# Altium schematic sheet Sheet1.SchDoc
size A4; SheetNumber: 1; SheetTotal: 2
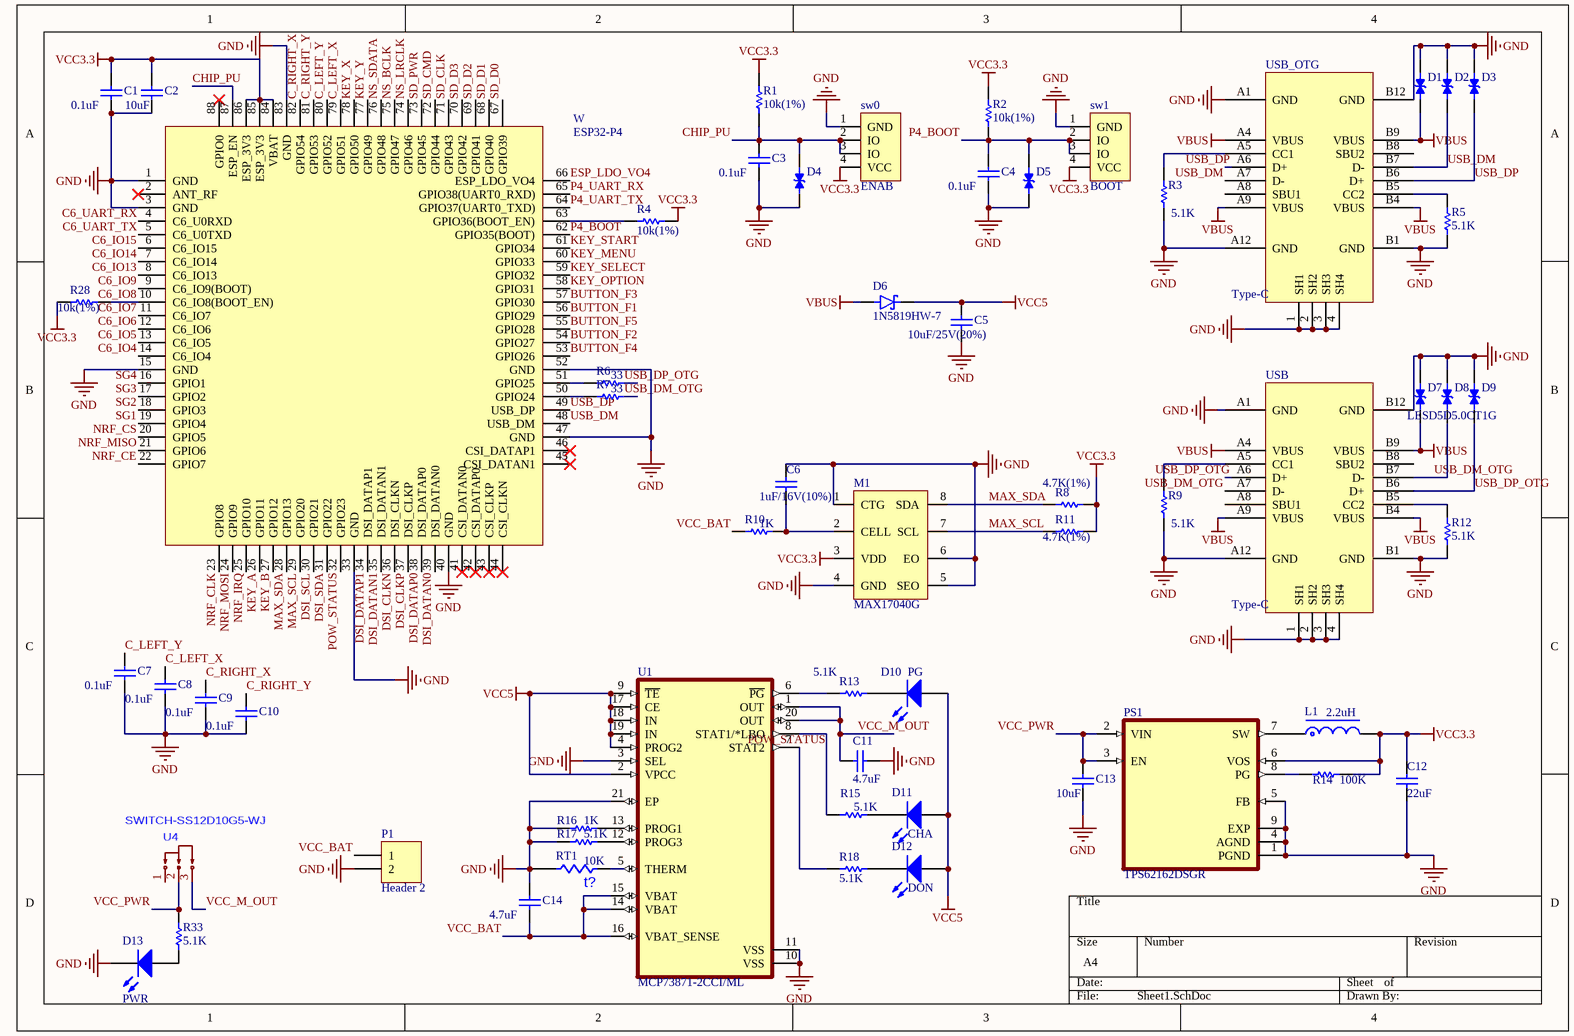
[diagram p0: Sheet1.SchDoc]

## Parts
C1  value 0.1uF  [C0805]  (hidden comment: 0.1uF/50V(10%))
C2  10uF  [C0805]
C3  value 0.1uF  [C0805]  (hidden comment: 0.1uF/50V(10%))
C4  value 0.1uF  [C0805]  (hidden comment: 0.1uF/50V(10%))
C5  10uF/25V(20%)  [C0805]
C6  1uF/16V(10%)  [C0805]
C7  value 0.1uF  [C0805]  (hidden comment: 0.1uF/50V(10%))
C8  value 0.1uF  [C0805]  (hidden comment: 0.1uF/50V(10%))
C9  value 0.1uF  [C0805]  (hidden comment: 0.1uF/50V(10%))
C10  value 0.1uF  [C0805]  (hidden comment: 0.1uF/50V(10%))
C11  4.7uF  [C0805]
C12  22uF  [C0805]
C13  10uF  [C0805]
C14  4.7uF  [C0805]
D1  (no value)  [TVS_LESD5D5.0CT1G]
D2  (no value)  [TVS_LESD5D5.0CT1G]
D3  (no value)  [TVS_LESD5D5.0CT1G]
D4  (no value)  [TVS_LESD5D5.0CT1G]
D5  (no value)  [TVS_LESD5D5.0CT1G]
D6  1N5819HW-7  [SOD3715X145N]
D7  (no value)  [TVS_LESD5D5.0CT1G]
D8  LESD5D5.0CT1G  [TVS_LESD5D5.0CT1G]
D9  (no value)  [TVS_LESD5D5.0CT1G]
D10  PG  [C0805]
D11  CHA  [C0805]
D12  DON  [C0805]
D13  PWR  [C0805]
L1  2.2uH  [INDC6060X300]
M1  MAX17040G  [MAX17040G+T]
P1  Header 2  [XH2.54-2P]
PS1  TPS62162DSGR  [TPS62162DSGR]
R1  10k(1%)  [C0805]
R2  10k(1%)  [C0805]
R3  5.1K  [C0805]
R4  10k(1%)  [C0805]
R5  5.1K  [C0805]
R6  33  [C0805]
R7  33  [C0805]
R8  4.7K(1%)  [C0805]
R9  5.1K  [C0805]
R10  1K  [C0805]
R11  4.7K(1%)  [C0805]
R12  5.1K  [C0805]
R13  5.1K  [C0805]
R14  100K  [C0805]
R15  5.1K  [C0805]
R16  1K  [C0805]
R17  5.1K  [C0805]
R18  5.1K  [C0805]
R28  10k(1%)  [C0805]
R33  5.1K  [C0805]
RT1  10K  [NTC]
sw0  ENAB  [SWITH_Light]
sw1  BOOT  [SWITH_Light]
U1  MCP73871-2CCI/ML  [MCP73871]
U4  SWITCH-SS12D10G5-WJ  [SW-TH_SS12D10G5]
USB  Type-C  [Type-C-TOP]
USB_OTG  Type-C  [Type-C-TOP]
W  ESP32-P4  [ESP32-P4_MODULE]

## Nets
GND: C1.1 C2.1 C3.1 C4.1 C5.1 C6.2 C7.1 C8.1 C9.1 C10.1 C11.2 C12.1 C13.1 C14.2 D1.2 D2.2 D3.2 D4.1 D5.1 D7.2 D8.2 D9.2 D13.2(K) M1.1(CTG) M1.4(GND) M1.5(SEO) M1.6(EO) P1.2 PS1.1(PGND) PS1.4(AGND) PS1.5(FB) PS1.9(EXP) R3.1 R5.1 R9.1 R12.1 R16.2 R17.2 RT1.2 sw0.1(GND) sw1.1(GND) U1.3(SEL) U1.10(VSS) U1.11(VSS) U1.21(EP) USB.1(SH1) USB.2(SH2) USB.3(SH3) USB.4(SH4) USB.A1(GND) USB.A12(GND) USB.B1(GND) USB.B12(GND) USB_OTG.1(SH1) USB_OTG.2(SH2) USB_OTG.3(SH3) USB_OTG.4(SH4) USB_OTG.A1(GND) USB_OTG.A12(GND) USB_OTG.B1(GND) USB_OTG.B12(GND) W.1(GND) W.3(GND) W.15(GND) W.33(GND) W.40(GND) W.47(GND) W.52(GND) W.83(GND)
VBUS: D1.1 D6.A D7.1 USB.A4(VBUS) USB.A9(VBUS) USB.B4(VBUS) USB.B9(VBUS) USB_OTG.A4(VBUS) USB_OTG.A9(VBUS) USB_OTG.B4(VBUS) USB_OTG.B9(VBUS)
VCC3.3: C1.2 C2.2 C12.2 L1.2 M1.3(VDD) PS1.6(VOS) R1.2 R2.2 R4.2 R8.2 R11.2 R14.1 R28.2 sw0.4(VCC) sw1.4(VCC) W.84(VBAT) W.85(ESP_3V3) W.86(ESP_3V3)
VCC5: C5.2 D6.C(K) D10.1(A) D11.1(A) D12.1(A) U1.2(VPCC) U1.4(PROG2) U1.9(~{TE}) U1.17(CE) U1.18(IN) U1.19(IN)
BUTTON_F1: W.56(GPIO29)
BUTTON_F2: W.54(GPIO27)
BUTTON_F3: W.57(GPIO30)
BUTTON_F4: W.53(GPIO26)
BUTTON_F5: W.55(GPIO28)
C6_IO4: W.14(C6_IO4)
C6_IO5: W.13(C6_IO5)
C6_IO6: W.12(C6_IO6)
C6_IO7: W.11(C6_IO7)
C6_IO8: R28.1 W.10(C6_IO8(BOOT_EN))
C6_IO9: W.9(C6_IO9(BOOT))
C6_IO13: W.8(C6_IO13)
C6_IO14: W.7(C6_IO14)
C6_IO15: W.6(C6_IO15)
C6_UART_RX: W.4(C6_U0RXD)
C6_UART_TX: W.5(C6_U0TXD)
C_LEFT_X: C8.2 W.79(GPIO51)
C_LEFT_Y: C7.2 W.80(GPIO52)
C_RIGHT_X: C9.2 W.82(GPIO54)
C_RIGHT_Y: C10.2 W.81(GPIO53)
CHIP_PU: C3.2 D4.2 R1.1 sw0.2(IO) sw0.3(IO) W.87(ESP_EN)
DSI_CLKN: W.36(DSI_CLKN)
DSI_CLKP: W.37(DSI_CLKP)
DSI_DATAN0: W.39(DSI_DATAN0)
DSI_DATAN1: W.35(DSI_DATAN1)
DSI_DATAP0: W.38(DSI_DATAP0)
DSI_DATAP1: W.34(DSI_DATAP1)
DSI_SCL: W.30(GPIO21)
DSI_SDA: W.31(GPIO22)
ESP_LDO_VO4: W.66(ESP_LDO_VO4)
KEY_A: W.26(GPIO11)
KEY_B: W.27(GPIO12)
KEY_MENU: W.60(GPIO33)
KEY_OPTION: W.58(GPIO31)
KEY_SELECT: W.59(GPIO32)
KEY_START: W.61(GPIO34)
KEY_X: W.78(GPIO50)
KEY_Y: W.77(GPIO49)
MAX_SCL: M1.7(SCL) R11.1 W.29(GPIO20)
MAX_SDA: M1.8(SDA) R8.1 W.28(GPIO13)
NRF_CE: W.22(GPIO7)
NRF_CLK: W.23(GPIO8)
NRF_CS: W.20(GPIO5)
NRF_IRQ: W.25(GPIO10)
NRF_MISO: W.21(GPIO6)
NRF_MOSI: W.24(GPIO9)
NS_BCLK: W.75(GPIO47)
NS_LRCLK: W.74(GPIO46)
NS_SDATA: W.76(GPIO48)
P4_BOOT: C4.2 D5.2 R2.1 sw1.2(IO) sw1.3(IO) W.62(GPIO35(BOOT))
P4_UART_RX: W.65(GPIO38(UART0_RXD))
P4_UART_TX: W.64(GPIO37(UART0_TXD))
POW_STATUS: R15.2 U1.8(STAT1/*LBO) W.32(GPIO23)
SD_CLK: W.71(GPIO43)
SD_CMD: W.72(GPIO44)
SD_D0: W.67(GPIO39)
SD_D1: W.68(GPIO40)
SD_D2: W.69(GPIO41)
SD_D3: W.70(GPIO42)
SD_PWR: W.73(GPIO45)
SG1: W.19(GPIO4)
SG2: W.18(GPIO3)
SG3: W.17(GPIO2)
SG4: W.16(GPIO1)
USB_DM: D2.1 USB_OTG.A7(D-) USB_OTG.B7(D-) W.48(USB_DM)
USB_DM_OTG: D8.1 R7.1 USB.A7(D-) USB.B7(D-)
USB_DP: D3.1 USB_OTG.A6(D+) USB_OTG.B6(D+) W.49(USB_DP)
USB_DP_OTG: D9.1 R6.1 USB.A6(D+) USB.B6(D+)
VCC_BAT: C14.1 P1.1 R10.1 U1.14(VBAT) U1.15(VBAT) U1.16(VBAT_SENSE)
VCC_M_OUT: C11.1 U1.1(OUT) U1.20(OUT) U4.3
VCC_PWR: C13.2 PS1.2(VIN) PS1.3(EN) R33.1 U4.2
NetC6_1: C6.1 M1.2(CELL) R10.2
NetD10_2: D10.2(K) R13.1
NetD11_2: D11.2(K) R15.1
NetD12_2: D12.2(K) R18.1
NetD13_1: D13.1(A) R33.2
NetL1_1: L1.1 PS1.7(SW)
NetPS1_8: PS1.8(PG) R14.2
NetR3_2: R3.2 USB_OTG.A5(CC1)
NetR4_1: R4.1 W.63(GPIO36(BOOT_EN))
NetR5_2: R5.2 USB_OTG.B5(CC2)
NetR6_2: R6.2 W.51(GPIO25)
NetR7_2: R7.2 W.50(GPIO24)
NetR9_2: R9.2 USB.A5(CC1)
NetR12_2: R12.2 USB.B5(CC2)
NetR13_2: R13.2 U1.6(~{PG})
NetR16_1: R16.1 U1.13(PROG1)
NetR17_1: R17.1 U1.12(PROG3)
NetR18_2: R18.2 U1.7(STAT2)
NetRT1_1: RT1.1 U1.5(THERM)

Not connected (* = marked no-connect by the designer): U4 1; USB A8(SBU1) B8(SBU2); USB_OTG A8(SBU1) B8(SBU2); W 2(ANT_RF)* 41(CSI_DATAN0)* 42(CSI_DATAP0)* 43(CSI_CLKP)* 44(CSI_CLKN)* 45(CSI_DATAN1)* 46(CSI_DATAP1)* 88(GPIO0)*

## Notes on the sheet
- (in symbol Res Thermal) t?

## Library data of the parts
C1-C14 = Cap: Capacitor; Published: 8-Jun-2000; LatestRevisionDate: 17-Jul-2002; LatestRevisionNote: Re-released for DXP Platform.; PackageReference: RAD-0.3; Publisher: Altium Limited; PackageDescription: Radial Cap, Thru-Hole; 2 Leads; 0.3 in Pin Spacing
D1-D5 D7-D9 = LESD5D5.0CT1G: Transient Voltage Suppressors for ESD Protection; MF: Leshan Radio Co.; Check_prices: https://www.snapeda.com/parts/LESD5D5.0CT1G/Leshan+Radio+Co./view-part/?ref=eda; Value: *; Availability: Not in stock; Package: None; SnapEDA_Link: https://www.snapeda.com/parts/LESD5D5.0CT1G/Leshan+Radio+Co./view-part/?ref=snap; MP: LESD5D5.0CT1G; Price: None
D6 = 1N5819HW-7: Diode Schottky 40 V 1A Surface Mount SOD-123; MF: Diodes Inc.; SnapEDA_Link: https://www.snapeda.com/parts/1N5819HW-7/Diodes+Inc./view-part/?ref=snap; Price: None; Check_prices: https://www.snapeda.com/parts/1N5819HW-7/Diodes+Inc./view-part/?ref=eda; Availability: In Stock; Value: *; MP: 1N5819HW-7; Package: SOD-123 Fairchild Semiconductor; Purchase-URL: https://pricing.snapeda.com/search/part/1N5819HW-7/?ref=eda
D10-D13 = LED0: Typical INFRARED GaAs LED; Published: 8-Jun-2000; LatestRevisionDate: 08-Jul-2005; LatestRevisionNote: Mech Layer 1 removed.; PackageReference: LED-0; Publisher: Altium Limited; PackageDescription: LED; 2 Leads
L1 = L-NR: NR功率电感; 版权归属: 源创客; BOM名称: NR功率电感; 学习资源: www.ooocke.com
M1 = MAX17040G: 电量检测
P1 = Header 2: Header, 2-Pin; LatestRevisionDate: 17-Jul-2002; LatestRevisionNote: Re-released for DXP Platform.; Publisher: Altium Limited
PS1 = TPS62162DSGR: 3V-17V 1A Step-Down Converters with DCS-Controlâ„¢; MF: Texas Instruments; SnapEDA_Link: https://www.snapeda.com/parts/TPS62162DSGR/Texas+Instruments/view-part/?ref=snap; Package: WSON-8 Texas Instruments; Value: *; MP: TPS62162DSGR; Check_prices: https://www.snapeda.com/parts/TPS62162DSGR/Texas+Instruments/view-part/?ref=eda
R1-R18 R28 R33 = Res1: Resistor; Published: 8-Jun-2000; LatestRevisionDate: 17-Jul-2002; LatestRevisionNote: Re-released for DXP Platform.; PackageReference: AXIAL-0.3; Publisher: Altium Limited; PackageDescription: Axial Device, Thru-Hole; 2 Leads; 0.3 in Pin Spacing
RT1 = Res Thermal: Published: 24-Mar-1999; LatestRevisionDate: 29-May-2009; LatestRevisionNote: IPC-7351 Footprint Added.; PackageVersion: Mar-2003; PackageReference: 6-0805; Publisher: Altium Limited; PackageDescription: Chip Resistor 0805 Case Size; Code_IPC: RESC2012
sw0 sw1 = SWITCH_LIGHT
U1 = MCP73871-2CCI/ML: Charger IC Lithium Ion/Polymer 20-QFN (4x4); MF: Microchip Technology; Package: QFN-20 Microchip; Price: None; Check_prices: https://www.snapeda.com/parts/MCP73871-2CCI/ML/Microchip/view-part/?ref=eda; Value: *; SnapEDA_Link: https://www.snapeda.com/parts/MCP73871-2CCI/ML/Microchip/view-part/?ref=snap; MP: MCP73871-2CCI/ML; Availability: In Stock; Purchase-URL: https://pricing.snapeda.com/search/part/MCP73871-2CCI/ML/?ref=eda
USB USB_OTG = USB-Type-C-TOP
W = ESP32-P4-Module: ESP32P4+ESP32C6; ComponentLink1Description: 供应商链接; ComponentLink1URL: http://www.szlcsc.com/product/details_24852.html; Package: QFN-24_4x4x05P; Supplier: LC; SuppliersPartNumber: C24112